# Altium schematic sheet 05_mPCIe.SchDoc: Power
size A3; Organization: Lime Microsystems; Address1: Surrey Tech Centre; Address2: Guildford GU2 7YG; Address3: Surrey; Address4: United Kingdom; Revision: v1.1; SheetNumber: 12; SheetTotal: 12
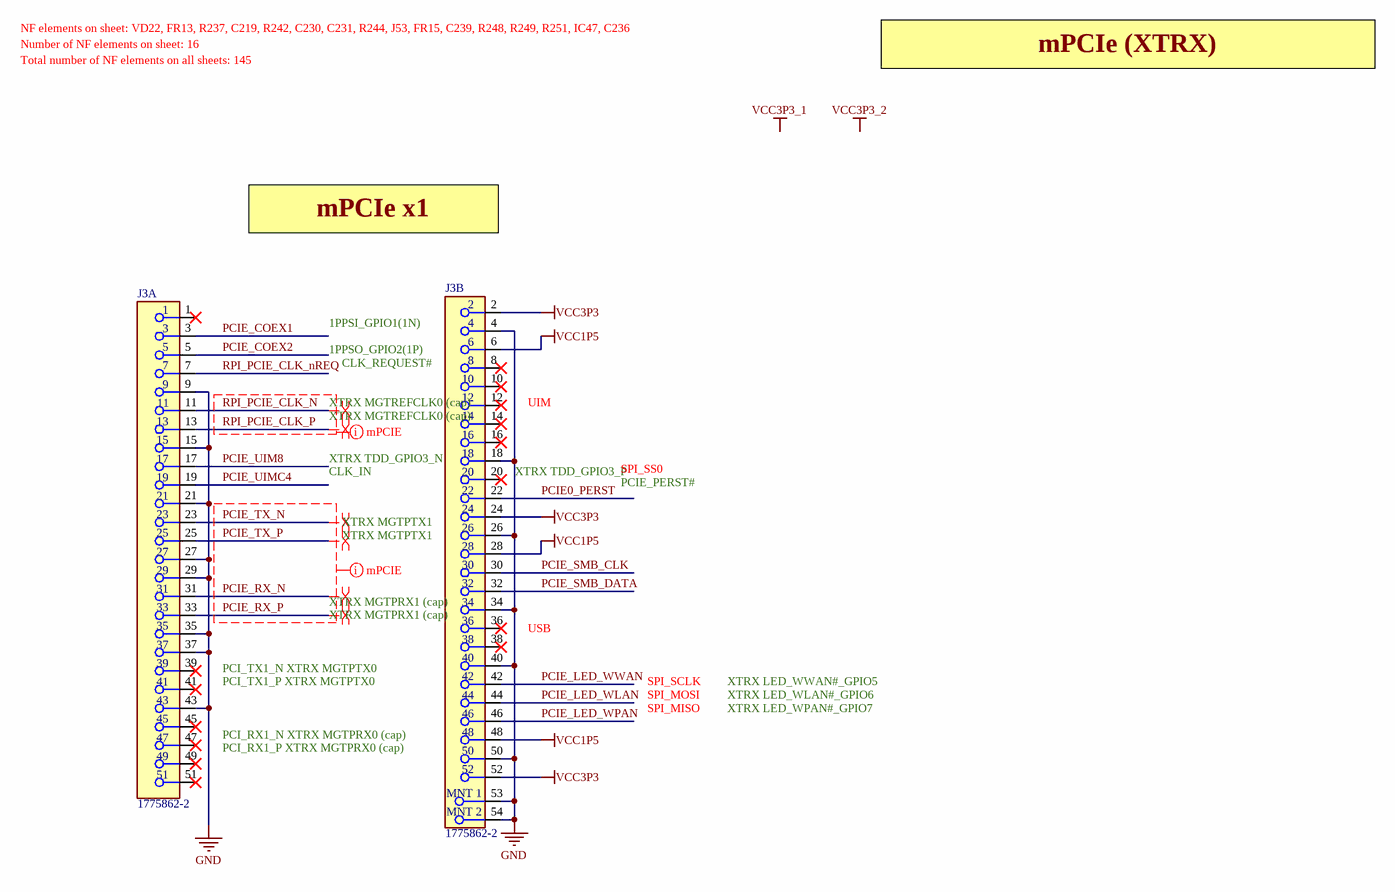
[diagram p0: 05_mPCIe.SchDoc]

## Parts
J3  1775862-2  [MiniPCIe_connector_XTRX]  (parts A,B of 2)

## Nets
GND: J3.4 J3.9 J3.15 J3.18 J3.21 J3.26 J3.27 J3.29 J3.34 J3.35 J3.37 J3.40 J3.43 J3.50 J3.53(MNT_1) J3.54(MNT_2)
VCC1P5: J3.6 J3.28 J3.48
VCC3P3: J3.2 J3.24 J3.52
PCIE0_PERST: J3.22
PCIE_COEX1: J3.3
PCIE_COEX2: J3.5
PCIE_LED_WLAN: J3.44
PCIE_LED_WPAN: J3.46
PCIE_LED_WWAN: J3.42
PCIE_RX_N: J3.31
PCIE_RX_P: J3.33
PCIE_SMB_CLK: J3.30
PCIE_SMB_DATA: J3.32
PCIE_TX_N: J3.23
PCIE_TX_P: J3.25
PCIE_UIM8: J3.17
PCIE_UIMC4: J3.19
RPI_PCIE_CLK_N: J3.11
RPI_PCIE_CLK_nREQ: J3.7
RPI_PCIE_CLK_P: J3.13

Not connected (* = marked no-connect by the designer): J3 1* 8* 10* 12* 14* 16* 20* 36* 38* 39* 41* 45* 47* 49* 51*

## Layout directives
net class RPI_PCIE: PCIE_RX_N, PCIE_RX_P, PCIE_TX_N, PCIE_TX_P, RPI_PCIE_CLK_N, RPI_PCIE_CLK_P
differential pair: PCIE_RX_N, PCIE_RX_P, PCIE_TX_N, PCIE_TX_P, RPI_PCIE_CLK_N, RPI_PCIE_CLK_P

## Notes on the sheet
- NF elements on sheet: VD22, FR13, R237, C219, R242, C230, C231, R244, J53, FR15, C239, R248, R249, R251, IC47, C236
- Number of NF elements on sheet: 16
- Total number of NF elements on all sheets: 145
- mPCIe (XTRX)
- mPCIe x1
- 1PPSO_GPIO2(1P)
- 1PPSI_GPIO1(1N)
- CLK_REQUEST#
- (near J3) XTRX MGTREFCLK0 (cap)
- (near J3) UIM
- XTRX TDD_GPIO3_N
- CLK_IN
- (near J3) XTRX TDD_GPIO3_P
- SPI_SS0
- PCIE_PERST#
- XTRX MGTPTX1
- (near J3) XTRX MGTPRX1 (cap)
- (near J3) USB
- (near J3) PCI_TX1_N XTRX MGTPTX0
- (near J3) PCI_TX1_P XTRX MGTPTX0
- SPI_SCLK
- SPI_MOSI
- XTRX LED_WWAN#_GPIO5
- XTRX LED_WLAN#_GPIO6
- (near J3) PCI_RX1_N XTRX MGTPRX0 (cap)
- (near J3) PCI_RX1_P XTRX MGTPRX0 (cap)
- SPI_MISO
- XTRX LED_WPAN#_GPIO7
- Labels drawn without touching a wire or pin: VCC3P3_1, VCC3P3_2
- Project name:
- Title:
- Size:
- Date:
- A3
- Revision:
- Time:
- Sheet
- of
- File:

## Library data of the parts
J3 = MINI_PCIE_FEMALE: CONN PCI EXP MINI FEMALE 52POS; Part Description: 52 Position Female Connector PCI Express Mini Card Gold 0.031" (0.80mm) Black; Manufacturer: TE Connectivity AMP; Manufacturer Part Number 1: 2041262-1; ComponentLink1URL: https://www.mouser.com/ds/2/418/NG_DS_8-1773459-7_EXPRESS_MINI_CARD_QRG_0816-907003.pdf?src-supplier=Mouser; ComponentLink1Description: https://www.mouser.com/ds/2/418/NG_DS_8-1773459-7_EXPRESS_MINI_CARD_QRG_0816-907003.pdf?src-supplier=Mouser; ComponentLink2URL: http://www.farnell.com/datasheets/2645681.pdf?src-supplier=Newark; ComponentLink2Description: http://www.farnell.com/datasheets/2645681.pdf?src-supplier=Newark; ComponentLink3URL: https://www.te.com/commerce/DocumentDelivery/DDEController?Action=srchrtrv&DocNm=108-99102&DocType=SS&DocLang=EN&src-supplier=Digi-Key; ComponentLink3Description: https://www.te.com/commerce/DocumentDelivery/DDEController?Action=srchrtrv&DocNm=108-99102&DocType=SS&DocLang=EN&src-supplier=Digi-Key; ComponentLink4URL: https://www.te.com/commerce/DocumentDelivery/DDEController?Action=srchrtrv&amp;DocNm=108-99102&amp;DocType=SS&amp;DocLang=EN&src-supplier=Digi-Key; ComponentLink4Description: https://www.te.com/commerce/DocumentDelivery/DDEController?Action=srchrtrv&amp;DocNm=108-99102&amp;DocType=SS&amp;DocLang=EN&src-supplier=Digi-Key; ComponentLink5URL: http://www.te.com/commerce/DocumentDelivery/DDEController?Action=showdoc&DocId=Customer+Drawing%7F2041262%7FC%7Fpdf%7FEnglish%7FENG_CD_2041262_C.pdf&src-supplier=Avnet; ComponentLink5Description: http://www.te.com/commerce/DocumentDelivery/DDEController?Action=showdoc&DocId=Customer+Drawing%7F2041262%7FC%7Fpdf%7FEnglish%7FENG_CD_2041262_C.pdf&src-supplier=Avnet; ComponentLink6URL: http://www.te.com/commerce/DocumentDelivery/DDEController?Action=srchrtrv&DocNm=2041262&DocType=Customer+Drawing&DocLang=English&src-supplier=Digi-Key; ComponentLink6Description: http://www.te.com/commerce/DocumentDelivery/DDEController?Action=srchrtrv&DocNm=2041262&DocType=Customer+Drawing&DocLang=English&src-supplier=Digi-Key; Supplier 1: Digi-Key; Supplier Part Number 1: A125147CT-ND; Stock 1: 45333; Pricing 1: 1=1,25000, 10=1,05300, 25=1,00960, 50=0,98820, 100=0,94520 (USD); RoHS: Yes